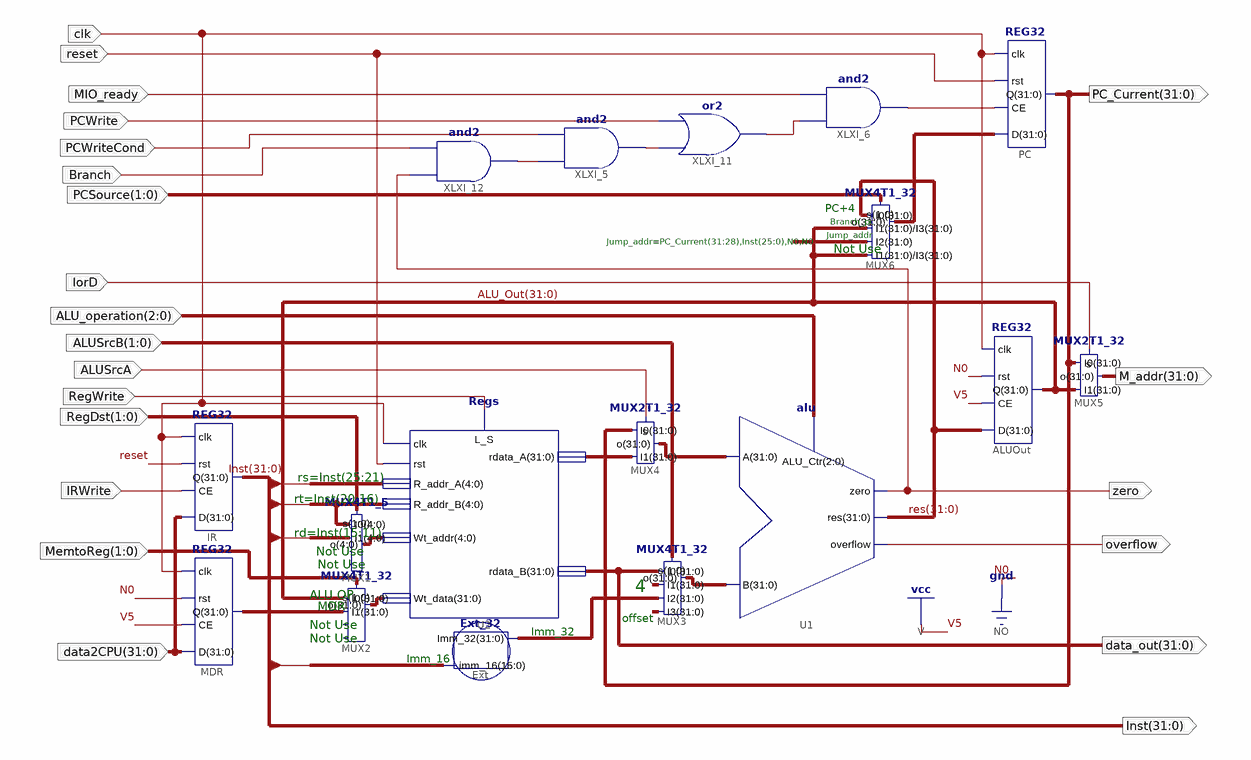
[diagram p0: schematic sheet 1]
// Xilinx ISE schematic MDPath.sch (kintex7) as structural Verilog: 17 symbols, 22 ports
module MDPath (
  input  [1:0] RegDst,
  input  [31:0] data2CPU,
  input  RegWrite,
  input  clk,
  input  reset,
  input  [2:0] ALU_operation,
  input  IorD,
  input  [1:0] PCSource,
  input  IRWrite,
  input  [1:0] MemtoReg,
  input  ALUSrcA,
  input  [1:0] ALUSrcB,
  input  PCWriteCond,
  input  Branch,
  input  MIO_ready,
  input  PCWrite,
  output [31:0] data_out,
  output [31:0] PC_Current,
  output [31:0] Inst,
  output zero,
  output overflow,
  output [31:0] M_addr
);

  wire XLXN_905, XLXN_910, XLXN_911, XLXN_929;
  wire [4:0] XLXN_803;
  wire [31:0] ALU_Out, Imm_32, res, XLXN_531, XLXN_590, XLXN_746, XLXN_747, XLXN_770, XLXN_930;

  alu U1 (.ALU_Ctr(ALU_operation), .res(res), .zero(zero), .overflow(overflow), .A(XLXN_746), .B(XLXN_531));
  Regs U2 (
    .clk(clk), .L_S(RegWrite), .rdata_A(XLXN_747), .rst(reset), .Wt_data(XLXN_770), .rdata_B(data_out),
    .R_addr_A(Inst[25:21]), .R_addr_B(Inst[20:16]), .Wt_addr(XLXN_803));
  Ext_32 Ext (.imm_16(Inst[15:0]), .Imm_32(Imm_32));
  REG32 ALUOut (.D(res), .CE(1'b1), .rst(1'b0), .clk(clk), .Q(ALU_Out));
  REG32 PC (.D(XLXN_930), .CE(XLXN_929), .rst(reset), .clk(clk), .Q(PC_Current));
  REG32 IR (.D(data2CPU), .CE(IRWrite), .rst(reset), .clk(clk), .Q(Inst));
  REG32 MDR (.D(data2CPU), .CE(1'b1), .rst(1'b0), .clk(clk), .Q(XLXN_590));
  and XLXI_5 (XLXN_905, XLXN_911, PCWriteCond);
  and XLXI_6 (XLXN_929, XLXN_910, MIO_ready);
  or XLXI_11 (XLXN_910, XLXN_905, PCWrite);
  MUX4T1_5 MUX1 (.s(RegDst), .I1(Inst[15:11]), .I0(Inst[20:16]), .o(XLXN_803));  // open: I2, I3
  MUX4T1_32 MUX2 (.s(MemtoReg), .I0(ALU_Out), .I1(XLXN_590), .o(XLXN_770));  // open: I2, I3
  MUX4T1_32 MUX3 (
    .s(ALUSrcB), .I0(data_out), .I1(32'b00000000000000000000000000000100), .I2(Imm_32),
    .I3({Imm_32[29:0], 2'b00}), .o(XLXN_531));
  MUX2T1_32 MUX4 (.s(ALUSrcA), .I0(PC_Current), .I1(XLXN_747), .o(XLXN_746));
  MUX4T1_32 MUX6 (
    .s(PCSource), .I0(res), .I1(ALU_Out), .I2({PC_Current[31:28], Inst[25:0], 2'b00}), .I3(ALU_Out),
    .o(XLXN_930));
  MUX2T1_32 MUX5 (.s(IorD), .I0(PC_Current), .I1(ALU_Out), .o(M_addr));
  and XLXI_12 (XLXN_911, zero, Branch);

  // Notes on the sheet:
  //   PC+4
  //   Branch_pc
  //   Jump_addr
  //   Jump_addr=PC_Current(31:28),Inst(25:0),N0,N0
  //   Not Use
  //   rs=Inst(25:21)
  //   rt=Inst(20:16)
  //   rd=Inst(15:11)
  //   Not Use
  //   Not Use
  //   4
  //   ALU OP
  //   MDR
  //   offset
  //   Not Use
  //   Imm_32
  //   Not Use
  //   Imm_16
endmodule
